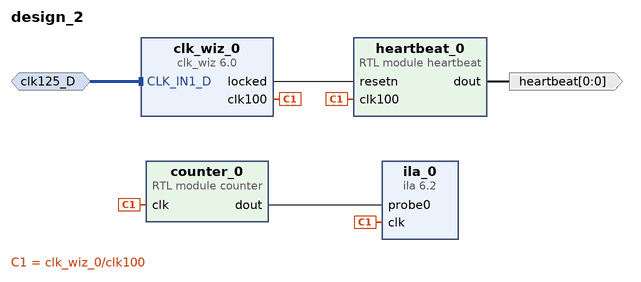
[diagram p0: block diagram of the top level]
# Vivado block design design_2, xcvu13p-flga2577-1-e, Vivado 2020.1
create_bd_design design_2

create_bd_intf_port -mode Slave -vlnv xilinx.com:interface:diff_clock_rtl:1.0 clk125_D
set_property -dict {CONFIG.FREQ_HZ 125000000} [get_bd_intf_ports clk125_D]
create_bd_port -dir O -from 0 -to 0 heartbeat

create_bd_cell -type ip -vlnv xilinx.com:ip:clk_wiz:6.0 clk_wiz_0
set_property -dict [list \
  CONFIG.CLKIN1_JITTER_PS 80.0 \
  CONFIG.CLKOUT1_JITTER 177.983 \
  CONFIG.CLKOUT1_PHASE_ERROR 222.305 \
  CONFIG.CLK_OUT1_PORT clk100 \
  CONFIG.MMCM_CLKFBOUT_MULT_F 48.000 \
  CONFIG.MMCM_CLKIN1_PERIOD 8.000 \
  CONFIG.MMCM_CLKIN2_PERIOD 10.000 \
  CONFIG.MMCM_CLKOUT0_DIVIDE_F 12.000 \
  CONFIG.MMCM_DIVCLK_DIVIDE 5 \
  CONFIG.PRIM_IN_FREQ 125 \
  CONFIG.PRIM_SOURCE Differential_clock_capable_pin \
  CONFIG.USE_RESET false \
] [get_bd_cells clk_wiz_0]
create_bd_cell -type ip -vlnv xilinx.com:ip:ila:6.2 ila_0
set_property -dict [list \
  CONFIG.ALL_PROBE_SAME_MU_CNT 2 \
  CONFIG.C_ADV_TRIGGER true \
  CONFIG.C_DATA_DEPTH 2048 \
  CONFIG.C_ENABLE_ILA_AXI_MON false \
  CONFIG.C_EN_STRG_QUAL 1 \
  CONFIG.C_MONITOR_TYPE Native \
  CONFIG.C_NUM_OF_PROBES 1 \
  CONFIG.C_PROBE0_MU_CNT 2 \
  CONFIG.C_PROBE0_WIDTH 6 \
  CONFIG.C_PROBE10_MU_CNT 2 \
  CONFIG.C_PROBE11_MU_CNT 2 \
  CONFIG.C_PROBE12_MU_CNT 2 \
  CONFIG.C_PROBE13_MU_CNT 2 \
  CONFIG.C_PROBE14_MU_CNT 2 \
  CONFIG.C_PROBE15_MU_CNT 2 \
  CONFIG.C_PROBE16_MU_CNT 2 \
  CONFIG.C_PROBE17_MU_CNT 2 \
  CONFIG.C_PROBE18_MU_CNT 2 \
  CONFIG.C_PROBE19_MU_CNT 2 \
  CONFIG.C_PROBE1_MU_CNT 2 \
  CONFIG.C_PROBE20_MU_CNT 2 \
  CONFIG.C_PROBE21_MU_CNT 2 \
  CONFIG.C_PROBE22_MU_CNT 2 \
  CONFIG.C_PROBE23_MU_CNT 2 \
  CONFIG.C_PROBE24_MU_CNT 2 \
  CONFIG.C_PROBE25_MU_CNT 2 \
  CONFIG.C_PROBE26_MU_CNT 2 \
  CONFIG.C_PROBE27_MU_CNT 2 \
  CONFIG.C_PROBE28_MU_CNT 2 \
  CONFIG.C_PROBE29_MU_CNT 2 \
  CONFIG.C_PROBE2_MU_CNT 2 \
  CONFIG.C_PROBE30_MU_CNT 2 \
  CONFIG.C_PROBE31_MU_CNT 2 \
  CONFIG.C_PROBE32_MU_CNT 2 \
  CONFIG.C_PROBE33_MU_CNT 2 \
  CONFIG.C_PROBE34_MU_CNT 2 \
  CONFIG.C_PROBE35_MU_CNT 2 \
  CONFIG.C_PROBE36_MU_CNT 2 \
  CONFIG.C_PROBE37_MU_CNT 2 \
  CONFIG.C_PROBE38_MU_CNT 2 \
  CONFIG.C_PROBE39_MU_CNT 2 \
  CONFIG.C_PROBE3_MU_CNT 2 \
  CONFIG.C_PROBE40_MU_CNT 2 \
  CONFIG.C_PROBE41_MU_CNT 2 \
  CONFIG.C_PROBE42_MU_CNT 2 \
  CONFIG.C_PROBE43_MU_CNT 2 \
  CONFIG.C_PROBE4_MU_CNT 2 \
  CONFIG.C_PROBE5_MU_CNT 2 \
  CONFIG.C_PROBE6_MU_CNT 2 \
  CONFIG.C_PROBE7_MU_CNT 2 \
  CONFIG.C_PROBE8_MU_CNT 2 \
  CONFIG.C_PROBE9_MU_CNT 2 \
] [get_bd_cells ila_0]
create_bd_cell -type module -reference counter counter_0
create_bd_cell -type module -reference heartbeat heartbeat_0
set_property -dict {CONFIG.OUTPUT_WIDTH 1} [get_bd_cells heartbeat_0]

# ---- connections ----

connect_bd_intf_net [get_bd_intf_ports clk125_D] [get_bd_intf_pins clk_wiz_0/CLK_IN1_D]
connect_bd_net -net clk_wiz_0_clk_out1 [get_bd_pins clk_wiz_0/clk100] \
  [get_bd_pins ila_0/clk] [get_bd_pins counter_0/clk] [get_bd_pins heartbeat_0/clk100]
connect_bd_net [get_bd_pins counter_0/dout] [get_bd_pins ila_0/probe0]
connect_bd_net [get_bd_pins clk_wiz_0/locked] [get_bd_pins heartbeat_0/resetn]
connect_bd_net [get_bd_pins heartbeat_0/dout] [get_bd_ports heartbeat]

validate_bd_design
save_bd_design
